# EAGLE schematic timing (EAGLE 9.4.2)
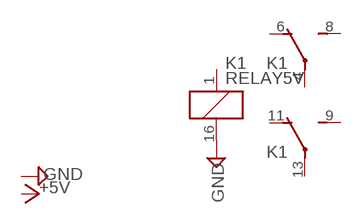
[diagram p0: schematic, sheet 1]

## Parts
K1  RELAY5V  [DS-BT]

## Nets
GND: K1.16(1:-)
Unconnected: K1.1(1:+) K1.4(2:P) K1.6(2:O) K1.8(2:S) K1.9(3:S) K1.11(3:O) K1.13(3:P)

## Library data of the parts
K1 = My:RELAY: DS-BT RELAYS 4,000 V BREAKDOWN VOLTAGE NAiS Source: http://www.mew-europe.com/.. en_ds_61005_0010.pdf